# EAGLE design Adafruit NeoPixel Ring 60 Quarter (EAGLE 6.4)
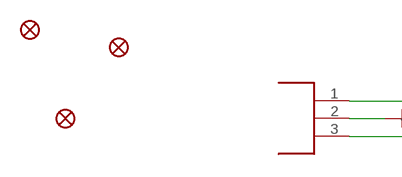
[diagram p0: schematic, sheet 1, part 1 of 2]
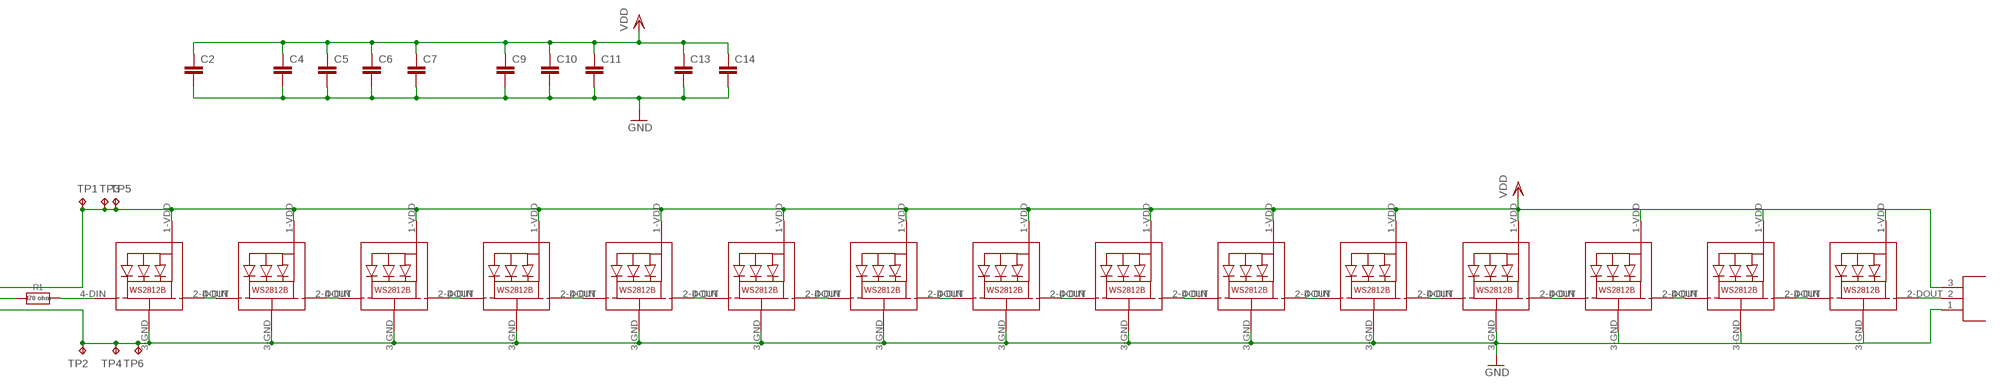
[diagram p1: schematic, sheet 1, part 2 of 2]

## Parts
C2  C-EUC0603  [C0603]
C4  C-EUC0603  [C0603]
C5  C-EUC0603  [C0603]
C6  C-EUC0603  [C0603]
C7  C-EUC0603  [C0603]
C9  C-EUC0603  [C0603]
C10  C-EUC0603  [C0603]
C11  C-EUC0603  [C0603]
C13  C-EUC0603  [C0603]
C14  C-EUC0603  [C0603]
FID1  FIDUCIAL""  [FIDUCIAL_1MM]
FID2  FIDUCIAL""  [FIDUCIAL_1MM]
FID3  FIDUCIAL""  [FIDUCIAL_1MM]
LED1  WS2812B5050-NARROW  [WS2812B-NARROW]
LED2  WS2812B5050-NARROW  [WS2812B-NARROW]
LED3  WS2812B5050-NARROW  [WS2812B-NARROW]
LED4  WS2812B5050-NARROW  [WS2812B-NARROW]
LED5  WS2812B5050-NARROW  [WS2812B-NARROW]
LED6  WS2812B5050-NARROW  [WS2812B-NARROW]
LED7  WS2812B5050-NARROW  [WS2812B-NARROW]
LED8  WS2812B5050-NARROW  [WS2812B-NARROW]
LED9  WS2812B5050-NARROW  [WS2812B-NARROW]
LED10  WS2812B5050-NARROW  [WS2812B-NARROW]
LED11  WS2812B5050-NARROW  [WS2812B-NARROW]
LED12  WS2812B5050-NARROW  [WS2812B-NARROW]
LED13  WS2812B5050-NARROW  [WS2812B-NARROW]
LED14  WS2812B5050-NARROW  [WS2812B-NARROW]
LED15  WS2812B5050-NARROW  [WS2812B-NARROW]
R1  470 ohm  RESISTOR_0603_NOOUT  [0603-NO]
TP1  TPTP20R  [TP20R]
TP2  TPTP20R  [TP20R]
TP3  TPTP20R  [TP20R]
TP4  TPTP20R  [TP20R]
TP5  TPTP20R  [TP20R]
TP6  TPTP20R  [TP20R]
U$1  RING_END_CONN_X3  [RING_END_CONN_X3]
U$2  RING_END_CONN_X3  [RING_END_CONN_X3]

## Nets
GND: C2.2 C4.2 C5.2 C6.2 C7.2 C9.2 C10.2 C11.2 C13.2 C14.2 LED1.3-GND(GND) LED2.3-GND(GND) LED3.3-GND(GND) LED4.3-GND(GND) LED5.3-GND(GND) LED6.3-GND(GND) LED7.3-GND(GND) LED8.3-GND(GND) LED9.3-GND(GND) LED10.3-GND(GND) LED11.3-GND(GND) LED12.3-GND(GND) LED13.3-GND(GND) LED14.3-GND(GND) LED15.3-GND(GND) TP2.TP TP4.TP TP6.TP U$1.3 U$2.1
N$1: LED1.2-DOUT(DO) LED2.4-DIN(DI)
N$2: LED2.2-DOUT(DO) LED3.4-DIN(DI)
N$3: LED3.2-DOUT(DO) LED4.4-DIN(DI)
N$4: LED4.2-DOUT(DO) LED5.4-DIN(DI)
N$5: LED5.2-DOUT(DO) LED6.4-DIN(DI)
N$6: LED6.2-DOUT(DO) LED7.4-DIN(DI)
N$7: LED7.2-DOUT(DO) LED8.4-DIN(DI)
N$8: LED8.2-DOUT(DO) LED9.4-DIN(DI)
N$9: LED9.2-DOUT(DO) LED10.4-DIN(DI)
N$10: LED10.2-DOUT(DO) LED11.4-DIN(DI)
N$11: LED11.2-DOUT(DO) LED12.4-DIN(DI)
N$12: LED12.2-DOUT(DO) LED13.4-DIN(DI)
N$13: LED13.2-DOUT(DO) LED14.4-DIN(DI)
N$14: LED14.2-DOUT(DO) LED15.4-DIN(DI)
N$15: LED1.4-DIN(DI) R1.2
N$16: LED15.2-DOUT(DO) U$2.2
N$17: R1.1 U$1.2
VDD: C2.1 C4.1 C5.1 C6.1 C7.1 C9.1 C10.1 C11.1 C13.1 C14.1 LED1.1-VDD(VDD) LED2.1-VDD(VDD) LED3.1-VDD(VDD) LED4.1-VDD(VDD) LED5.1-VDD(VDD) LED6.1-VDD(VDD) LED7.1-VDD(VDD) LED8.1-VDD(VDD) LED9.1-VDD(VDD) LED10.1-VDD(VDD) LED11.1-VDD(VDD) LED12.1-VDD(VDD) LED13.1-VDD(VDD) LED14.1-VDD(VDD) LED15.1-VDD(VDD) TP1.TP TP3.TP TP5.TP U$1.1 U$2.3

## Library data of the parts
C2 C4-C7 C9-C11 C13 C14 = rcl:C-EU: CAPACITOR, European symbol
FID1-FID3 = microbuilder:FIDUCIAL: Fiducial Alignment Points Various fiducial points for machine vision alignment.; BOM: EXCLUDE
LED1-LED15 = microbuilder:WS2812B5050
R1 = microbuilder:RESISTOR: Resistors For new designs, use the packages preceded by an '_' character since they are more reliable: The following footprints should be used on most boards: _0402 - Standard footprint for regular board layouts _0603 - Standard footprint for regular board layouts _0805 - Standard footprint for regular board layouts _1206 - Standard footprint for regular board layouts For extremely tight-pitch boards where space is at a premium, the following 'micro-pitch' footprints can be used (smaller pads, no silkscreen outline, etc.): _0402MP - Micro-pitch footprint for very dense/compact boards _0603MP - Micro-pitch footprint for very dense/compact boards _0805MP - Micro-pitch footprint for very dense/compact boards _1206MP - Micro-pitch footprint for very dense/compact boards
TP1-TP6 = testpad:TP: Test pad
U$1 U$2 = NeoPixelRing:RING_END_CONN_X3

## Board
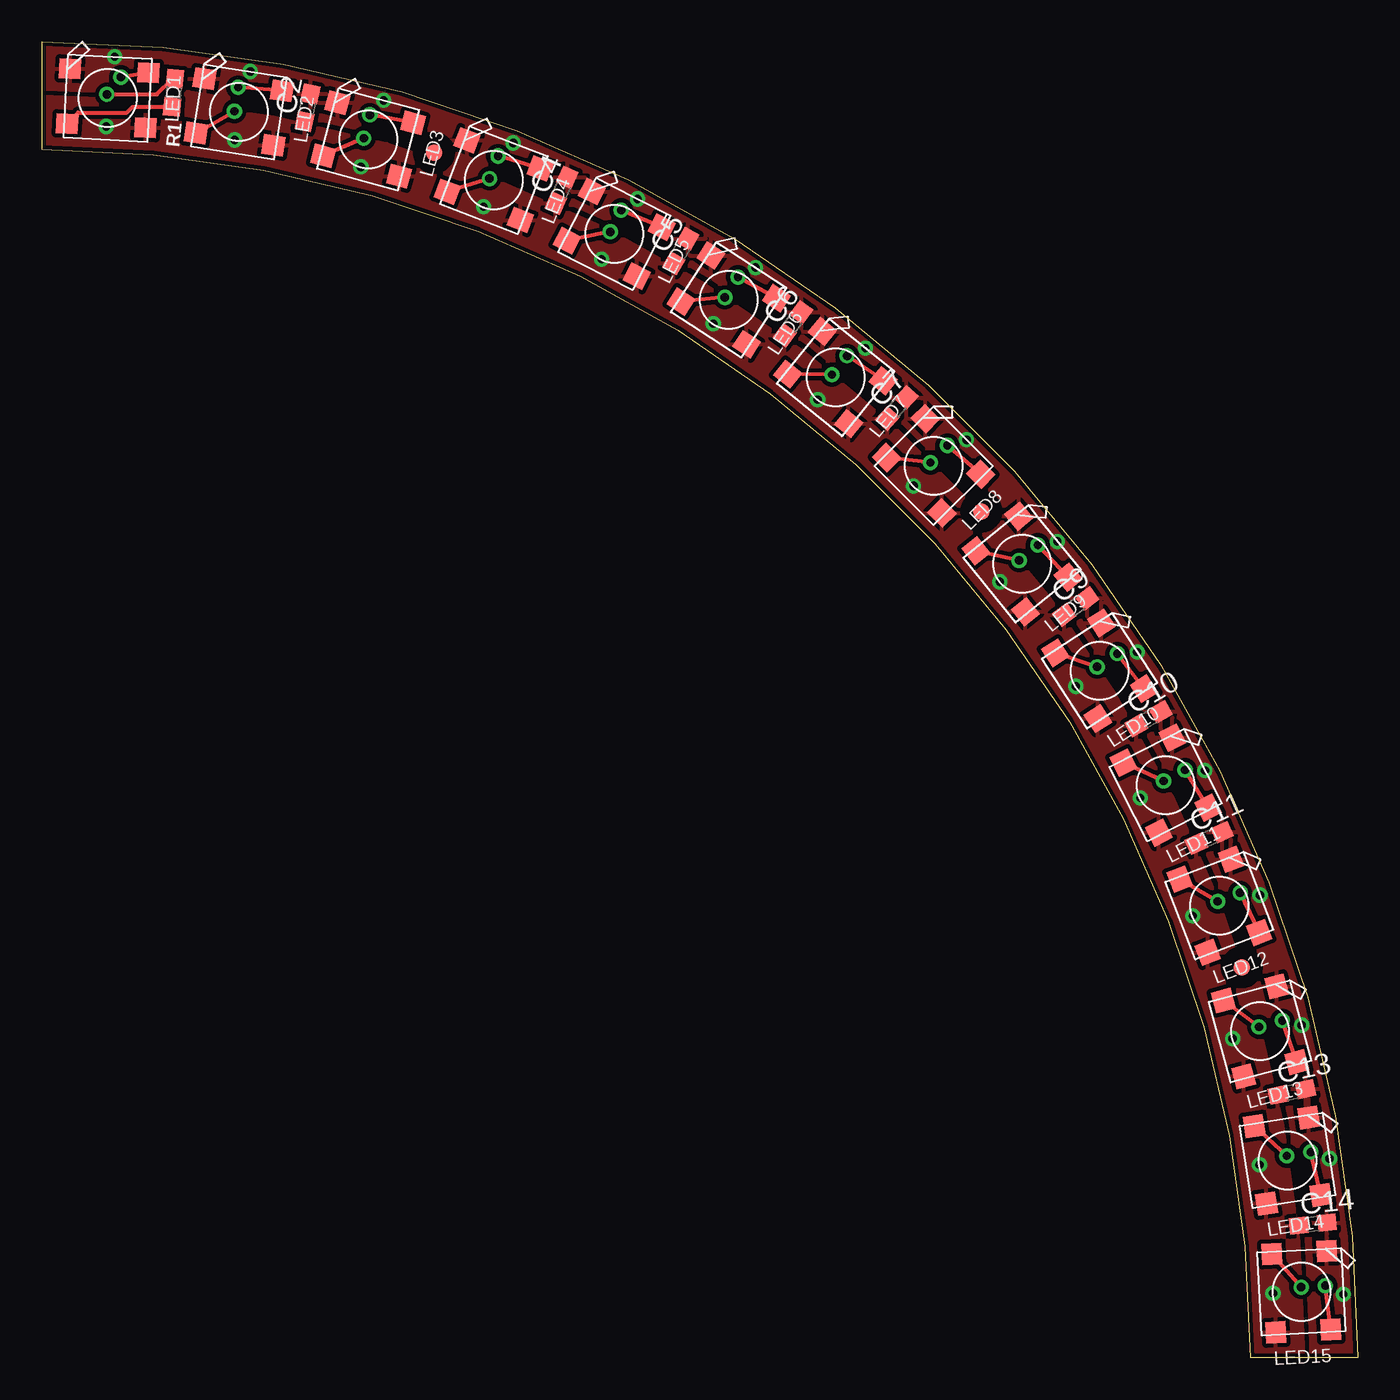
[diagram p2: board, top side]
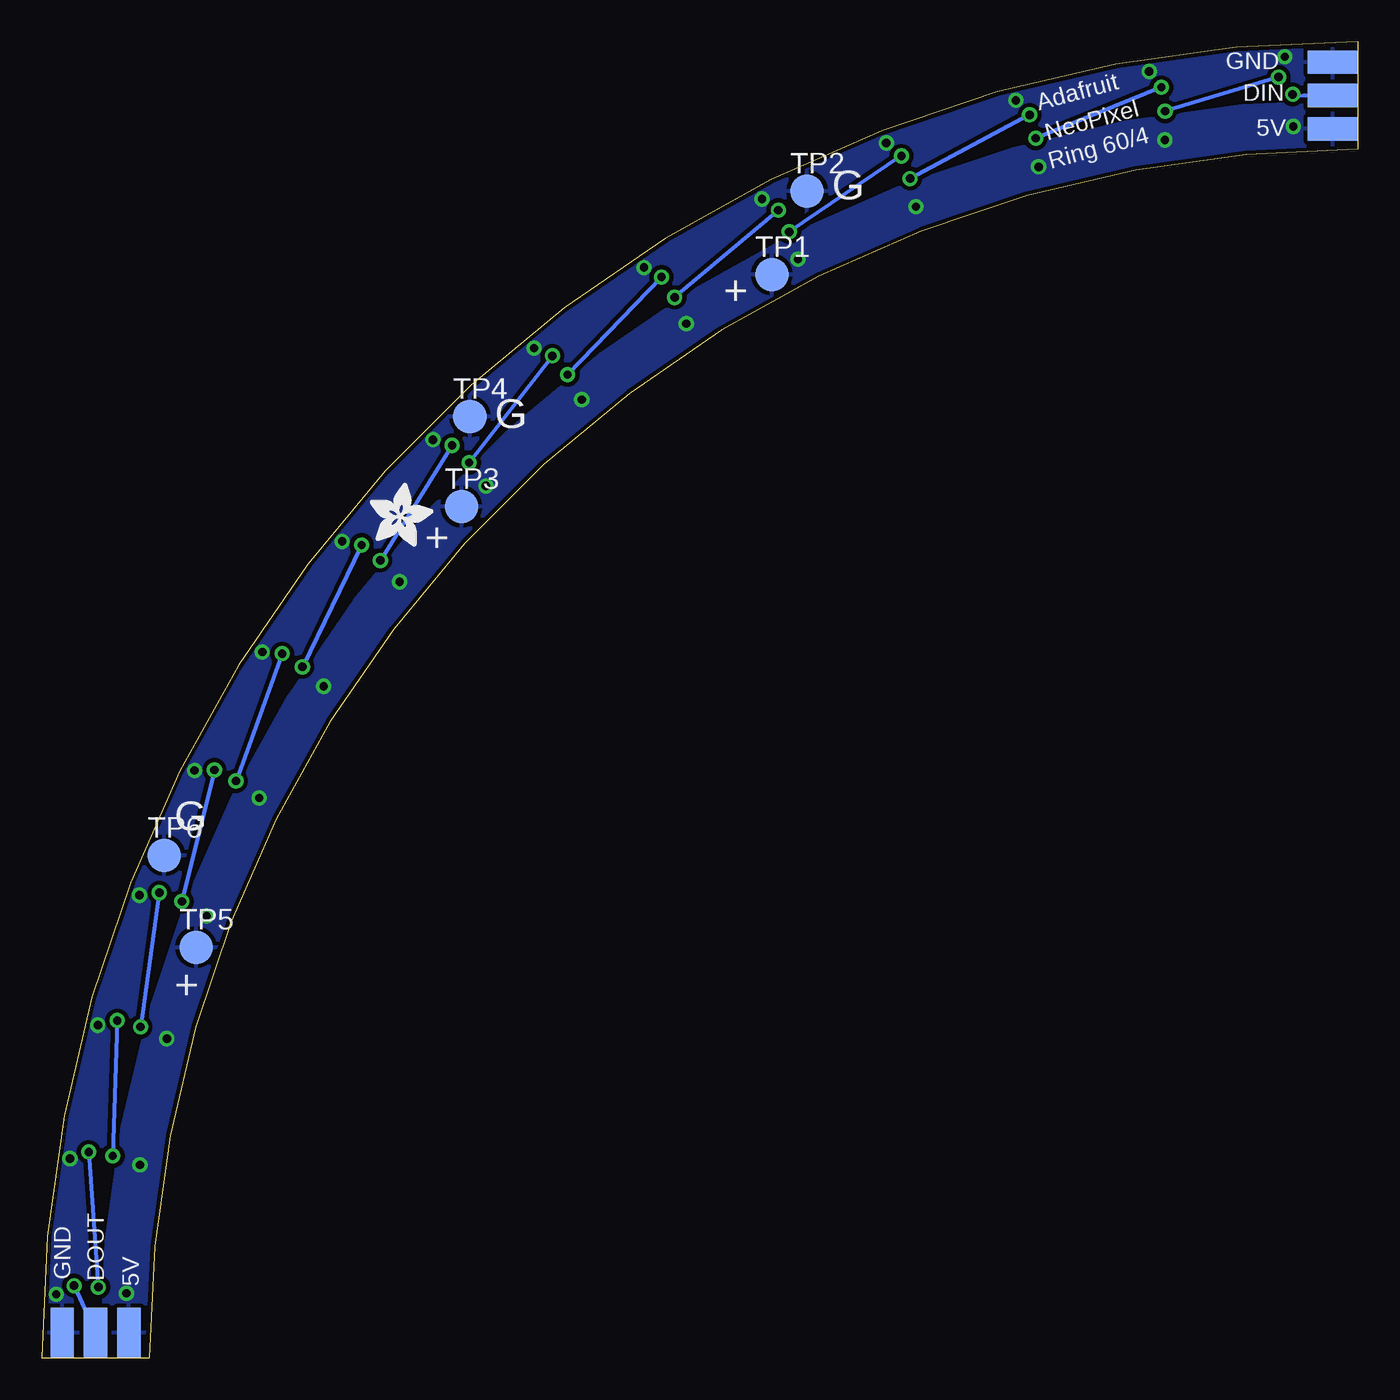
[diagram p3: board, bottom side, seen from below]

Size 78.85 x 78.85 mm. Coordinates in mm from the lower left corner, seen from the top.
Outline: 0,78.85 0,72.4 arc-90 72.4,0 78.85,0 arc90 0,78.85
Copper layers (1*16): Top 0.035mm / dielectric 1.5mm / Bottom 0.035mm
Design rules "adafruit_rules_1 *": minimum track width 8mil, minimum drill 15.5mil, track to track 8mil, track to pad 8mil, pad to pad 8mil, via to via 8mil, smd to smd 8mil, copper to edge 10mil, drill to drill 8mil, minimum pad ring 10mil, minimum via ring 8mil, stop-mask expansion 4mil, vias tented up to drill 25mil, thermal gap 10mil

### Footprints (pad centres in the part's own frame; a part is rotated, then mirrored left to right if it is on the bottom)
C0603 = smd 1.1 x 1: 1 -0.85,0; 2 0.85,0
FIDUCIAL_1MM = smd 1 x 1: 1 0,0
WS2812B-NARROW = smd 1.3 x 1.2: 1-VDD 2.35,-1.65; 2-DOUT 2.35,1.65; 3-GND -2.35,1.65; 4-DIN -2.35,-1.65
0603-NO = smd 1.1 x 1: 1 -0.85,0; 2 0.85,0
TP20R = smd 2 x 2: TP 0,0
RING_END_CONN_X3 = smd 3 x 1.4: 1 1.5,2; 2 1.5,0; 3 1.5,-2

### Placement (x,y rotation side)
C2  15.92,74.9 78 top
C4  31.15,69.95 66 top
C5  38.29,66.32 60 top
C6  45.01,61.95 54 top
C7  51.24,56.91 48 top
C9  61.95,45.01 36 top
C10  66.32,38.29 30 top
C11  69.95,31.15 24 top
C13  74.9,15.92 12 top
C14  76.16,8 6 top
FID1  23.5,72.2 0 top
FID2  56.3,50.7 0 top
FID3  71.9,23.4 0 top
LED1  3.96,75.47 357 top
LED2  11.82,74.64 351 top
LED3  19.56,73 345 top
LED4  27.08,70.56 339 top
LED5  34.31,67.34 333 top
LED6  41.16,63.38 327 top
LED7  47.56,58.73 321 top
LED8  53.44,53.44 315 top
LED9  58.73,47.56 309 top
LED10  63.38,41.16 303 top
LED11  67.34,34.31 297 top
LED12  70.56,27.08 291 top
LED13  73,19.56 285 top
LED14  74.64,11.82 279 top
LED15  75.47,3.96 273 top
R1  7.9,75.8 264 top
TP1  35.1,64.9 0 bottom
TP2  33,69.9 0 bottom
TP3  53.7,51 0 bottom
TP4  53.2,56.4 0 bottom
TP5  69.6,24.6 0 bottom
TP6  71.5,30.1 0 bottom
U$1  0,75.62 180 bottom
U$2  75.62,0 90 bottom
U$3  [ADAFRUIT_3.5MM]  59.2,48.6 0 bottom

### Tracks (layer width: path | path; a pad name or v marks a point on that pad's centre or on a via)
GND  (via drill 0.5)
  other vias: 4.37,77.95 12.5,77.07 20.48,75.34 28.25,72.79 35.7,69.43 42.76,65.32 49.36,60.49 55.41,55 60.86,48.91 65.63,42.28 69.69,35.19 72.99,27.71 75.49,19.93 77.16,11.93 77.98,3.8
  pour Top (isolate 0.254, rank 2): 0,72 0,79 arc-90 79,0 72,0 arc90
  pour Bottom (isolate 0.254): 0,76 arc-90 76,0 79,0 arc90 0,79
N$1  (via drill 0.5)
  Top 0.254: v11.55,74.69 LED2.4-DIN | LED1.2-DOUT v4.75,76.73
  Bottom 0.254: v4.75,76.73 v11.55,74.69
N$2  (via drill 0.5)
  Top 0.254: v19.29,73.07 LED3.4-DIN | LED2.2-DOUT v11.77,76.12
  Bottom 0.254: v11.77,76.12 v19.29,73.07
N$3  (via drill 0.5)
  Top 0.254: v26.82,70.65 LED4.4-DIN | LED3.2-DOUT v19.66,74.47
  Bottom 0.254: v19.66,74.47 v26.82,70.65
N$4  (via drill 0.5)
  Top 0.254: v34.06,67.46 LED5.4-DIN | LED4.2-DOUT v27.34,72.01
  Bottom 0.254: v27.34,72.01 v34.06,67.46
N$5  (via drill 0.5)
  Top 0.254: v40.93,63.53 LED6.4-DIN | LED5.2-DOUT v34.72,68.76
  Bottom 0.254: v34.72,68.76 v40.93,63.53
N$6  (via drill 0.5)
  Top 0.254: v47.34,58.91 LED7.4-DIN | LED6.2-DOUT v41.71,64.75
  Bottom 0.254: v41.71,64.75 v47.34,58.91
N$7  (via drill 0.5)
  Top 0.254: v53.24,53.63 LED8.4-DIN | LED7.2-DOUT v48.25,60.04
  Bottom 0.254: v48.25,60.04 v53.24,53.63
N$8  (via drill 0.5)
  Top 0.254: v58.56,47.78 LED9.4-DIN | LED8.2-DOUT v54.27,54.66
  Bottom 0.254: v54.27,54.66 v58.56,47.78
N$9  (via drill 0.5)
  Top 0.254: v63.23,41.39 LED10.4-DIN | LED9.2-DOUT v59.68,48.69
  Bottom 0.254: v59.68,48.69 v63.23,41.39
N$10  (via drill 0.5)
  Top 0.254: v67.21,34.56 LED11.4-DIN | LED10.2-DOUT v64.44,42.19
  Bottom 0.254: v64.44,42.19 v67.21,34.56
N$11  (via drill 0.5)
  Top 0.254: v70.45,27.34 LED12.4-DIN | LED11.2-DOUT v68.5,35.22
  Bottom 0.254: v68.5,35.22 v70.45,27.34
N$12  (via drill 0.5)
  Top 0.254: v72.93,19.83 LED13.4-DIN | LED12.2-DOUT v71.81,27.87
  Bottom 0.254: v71.81,27.87 v72.93,19.83
N$13  (via drill 0.5)
  Top 0.254: LED14.4-DIN v74.6,12.1 | LED13.2-DOUT v74.33,20.21
  Bottom 0.254: v74.33,20.21 v74.6,12.1
N$14  (via drill 0.5)
  Top 0.254: LED15.4-DIN v75.46,4.23 | LED14.2-DOUT v76.03,12.33
  Bottom 0.254: v76.03,12.33 v75.46,4.23
N$15
  Top 0.254: LED1.4-DIN 2.18,74.6 5.1,74.6 5.46,74.95 R1.2
N$16  (via drill 0.5)
  Top 0.254: LED15.2-DOUT v76.91,4.32
  Bottom 0.254: v76.91,4.32 U$2.2
N$17  (via drill 0.5)
  Top 0.254: 8.1,76.76 R1.1 7.84,76.64 6.9,75.7 v3.9,75.7
  Bottom 0.254: U$1.2 3.23,75.62 3.8,75.6 v3.9,75.7
VDD  (via drill 0.5)
  other vias: 3.87,73.77 11.56,72.97 19.12,71.36 26.47,68.97 33.54,65.82 40.24,61.96 46.49,57.41 52.24,52.24 57.41,46.49 61.96,40.24 65.82,33.54 68.97,26.47 71.36,19.12 72.97,11.56 73.77,3.87
  pour Top (isolate 0.254): 0,72 0,75.6 arc-90 75.6,0 72,0 arc90
  pour Bottom (isolate 0.254): 0,72 0,75.3 arc-90 75.3,0 72,0 arc90

### Text on the board
bPlace: GND | DIN | Adafruit | 5V | NeoPixel | Ring 60/4 | G | + | G | + | G | + | DOUT | GND | 5V